# Altium project Test_Board.PrjPcb
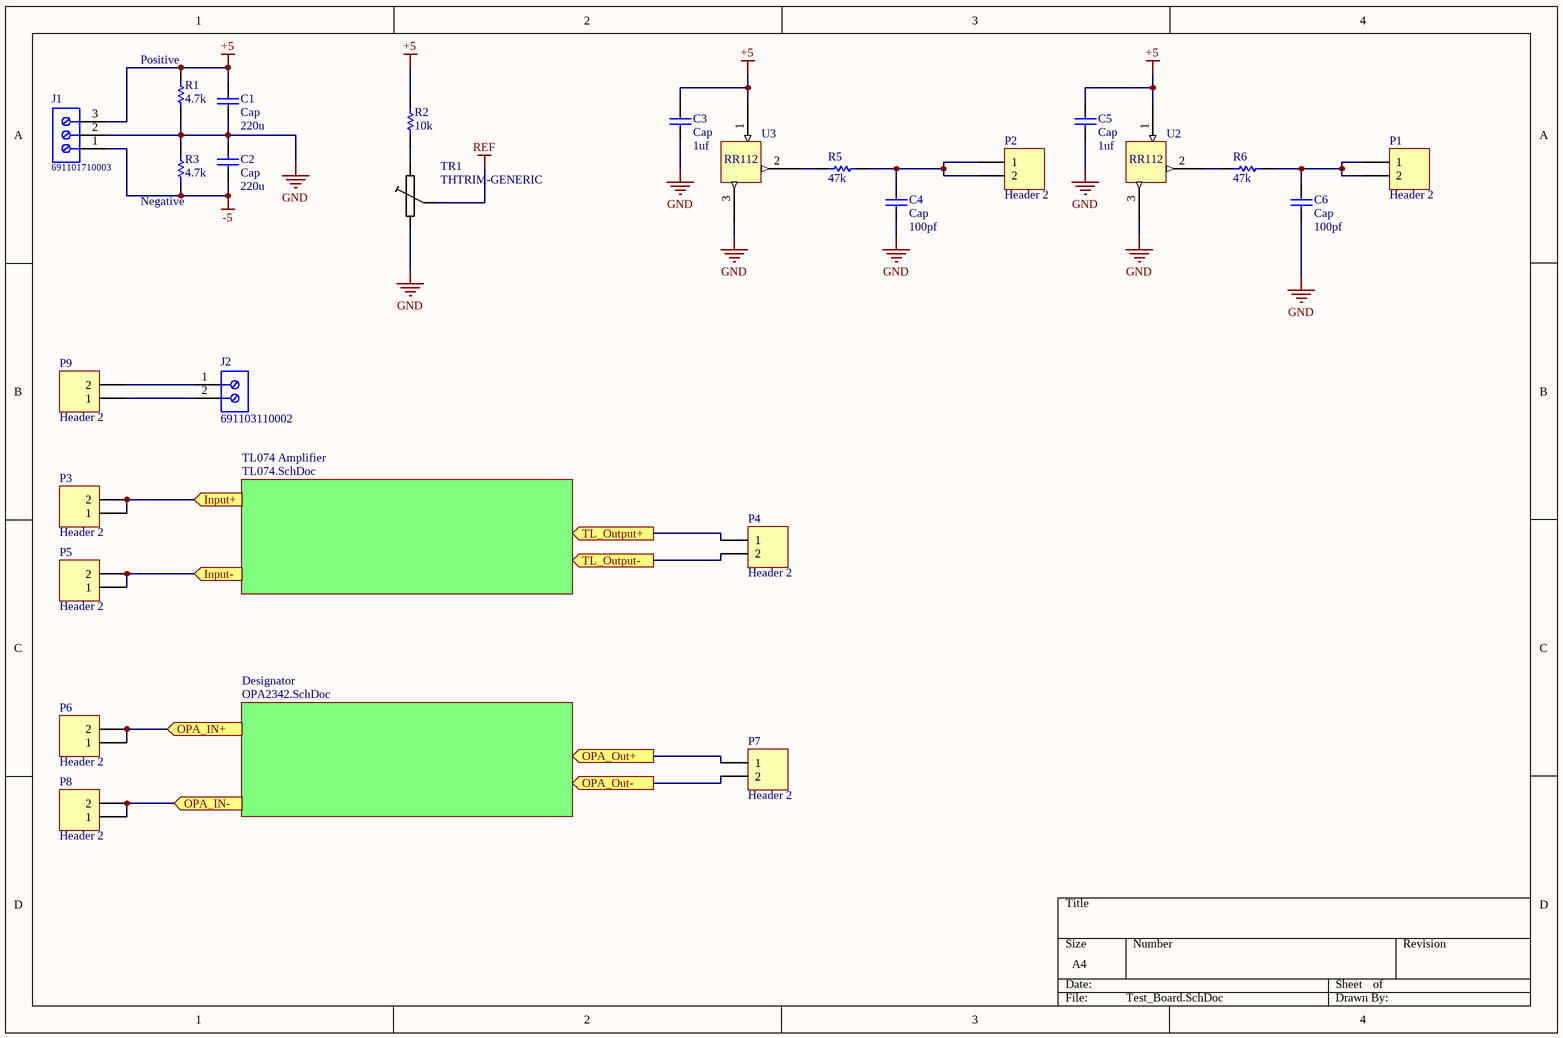
[diagram p0: Test_Board.SchDoc]
3 sheets, 50 parts. Net scope: flat (ports and power ports of the same name join across sheets).
Board file: TestBoard.PcbDoc
Sheets:
  Test_Board.SchDoc
    TL074 Amplifier = TL074.SchDoc
    Designator = OPA2342.SchDoc

## Sheet Test_Board.SchDoc
size A4; SheetNumber: 1; SheetTotal: 3

### Parts
C1  Cap  value 220u  [RAD-0.3]
C2  Cap  value 220u  [C1206]
C3  Cap  value 1uf  [C1206]
C4  Cap  value 100pf  [C1206]
C5  Cap  value 1uf  [C1206]
C6  Cap  value 100pf  [C1206]
J1  691101710003  [691101710003]
J2  691103110002  [691103110002]
P1  Header 2  [HDR1X2]
P2  Header 2  [HDR1X2]
P3  Header 2  [HDR1X2]
P4  Header 2  [HDR1X2]
P5  Header 2  [HDR1X2]
P6  Header 2  [HDR1X2]
P7  Header 2  [HDR1X2]
P8  Header 2  [HDR1X2]
P9  Header 2  [HDR1X2]
R1  4.7k  [RESC3216X89X51LL25T25]
R2  10k  [RESC3216X89X51LL25T25]
R3  4.7k  [RESC3216X89X51LL25T25]
R5  47k  [RESC3216X89X51LL25T25]
R6  47k  [RESC3216X89X51LL25T25]
TR1  THTRIM-GENERIC  [TRIMMER-MT]
U2  RR112-1G42-531  [SOT145P280X140-3N]  (value not drawn)
U3  RR112-1G42-531  [SOT145P280X140-3N]  (value not drawn)

### Sub-sheets
Designator = OPA2342.SchDoc: no entries
TL074 Amplifier = TL074.SchDoc: no entries

### Ports
Input+ (in), Input- (in), OPA_IN+ (in), OPA_IN- (in), OPA_Out+ (out), OPA_Out- (out), TL_Output+ (out), TL_Output- (out)

### Nets
+5: C1.1 C3.1 C5.1 J1.3 R1.2 R2.2 U2.1(Vdd) U3.1(Vdd)
-5: C2.2 J1.1 R3.1
GND: C1.2 C2.1 C3.2 C4.2 C5.2 C6.2 J1.2 R1.1 R3.2 TR1.1 U2.3(GND) U3.3(GND)
REF: TR1.W
NetC4_1: C4.1 P2.1 P2.2 R5.1
NetC6_1: C6.1 P1.1 P1.2 R6.1
NetJ2_1: J2.1 P9.2
NetJ2_2: J2.2 P9.1
NetP3_1: P3.1 P3.2 ; port Input+
NetP4_1: P4.1 ; port TL_Output+
NetP4_2: P4.2 ; port TL_Output-
NetP5_1: P5.1 P5.2 ; port Input-
NetP6_1: P6.1 P6.2 ; port OPA_IN+
NetP7_1: P7.1 ; port OPA_Out+
NetP7_2: P7.2 ; port OPA_Out-
NetP8_1: P8.1 P8.2 ; port OPA_IN-
NetR2_1: R2.1 TR1.2
NetR5_2: R5.2 U3.2(Output)
NetR6_2: R6.2 U2.2(Output)

### Notes on the sheet
- (near R1) Positive
- (near R3) Negative
- (in symbol CMP-010-0002465-1) RR112

### Library data of the parts
C1-C6 = Cap: Capacitor; Published: 8-Jun-2000; LatestRevisionDate: 17-Jul-2002; LatestRevisionNote: Re-released for DXP Platform.; PackageReference: RAD-0.3; Publisher: Altium Limited; PackageDescription: Radial Cap, Thru-Hole; 2 Leads; 0.3 in Pin Spacing
J1 = CMP-1502-03257-1: Series 101 - 5.00 mm Horizontal Entry Modular with Pressure Clamp WR-TBL, 3 pin; Manufacturer: Wurth Elektronik; Pitch: 5.00mm; Pin Number: 3; Publisher: WurthElektronik; Part Number: 691101710003; Operating Temperature: -40to105degC; Package Reference: 691101710003; Packaging: Box; Manufacturer URL: http://www.we-online.de; Datasheet URL: http://katalog.we-online.de/em/datasheet/6911017100xx.pdf; Mounting Technology: THT
J2 = CMP-1502-03254-1: Series 1031 - 3.50 mm Horizontal Entry Modular with Pressure Clamp WR-TBL, 2 pin; Manufacturer: Wurth Elektronik; Pin Number: 2; Pitch: 3.50mm; Datasheet URL: http://katalog.we-online.de/em/datasheet/6911031100xx.pdf; Package Reference: 691103110002; Publisher: WurthElektronik; Manufacturer URL: http://www.we-online.de; Mounting Technology: THT; Operating Temperature: -40to105degC; Part Number: 691103110002; Packaging: Box
P1-P9 = Header 2: Header, 2-Pin; LatestRevisionDate: 17-Jul-2002; LatestRevisionNote: Re-released for DXP Platform.; Publisher: Altium Limited
R1-R3 R5 R6 = CMP-2003-04376-1: Part Number: WSLP1206R0500FEA; Manufacturer: Vishay Dale
TR1 = THTRIM-GENERIC: TRIMMABLE RESISTOR
U2 U3 = CMP-010-0002465-1: TMR Sensor

## Sheet TL074.SchDoc
size A4; SheetNumber: 2; SheetTotal: 3
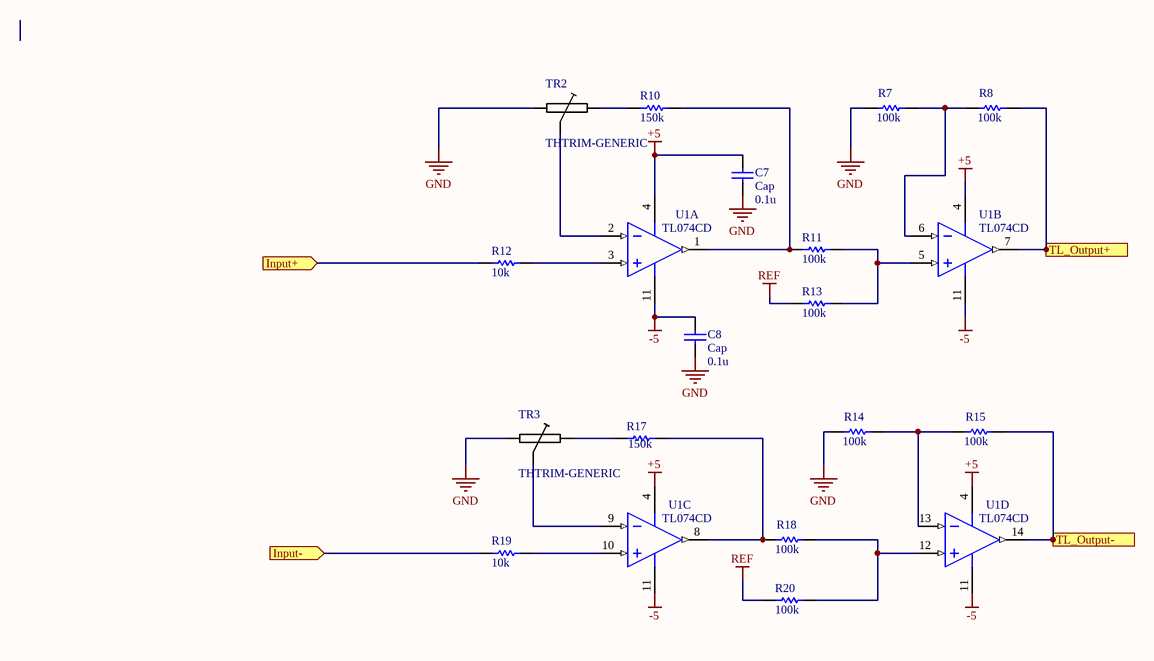
[diagram p1: TL074.SchDoc]

### Parts
C7  Cap  value 0.1u  [C1206]
C8  Cap  value 0.1u  [C1206]
R7  100k  [RESC3216X89X51LL25T25]
R8  100k  [RESC3216X89X51LL25T25]
R10  150k  [RESC3216X89X51LL25T25]
R11  100k  [RESC3216X89X51LL25T25]
R12  10k  [RESC3216X89X51LL25T25]
R13  100k  [RESC3216X89X51LL25T25]
R14  100k  [RESC3216X89X51LL25T25]
R15  100k  [RESC3216X89X51LL25T25]
R17  150k  [RESC3216X89X51LL25T25]
R18  100k  [RESC3216X89X51LL25T25]
R19  10k  [RESC3216X89X51LL25T25]
R20  100k  [RESC3216X89X51LL25T25]
TR2  THTRIM-GENERIC  [TRIMMER-MT]
TR3  THTRIM-GENERIC  [TRIMMER-MT]
U1  TL074CD  [D0014A_M]  (parts A,B,C,D of 4)

### Ports
Input+ (in), Input- (in), TL_Output+ (out), TL_Output- (out)

### Nets
+5: C7.1 U1.4(VCC+)
-5: C8.1 U1.11(VCC-)
GND: C7.2 C8.2 R7.2 R14.2 TR2.1 TR3.1
REF: R13.2 R20.2
NetP3_1: R12.2 ; port Input+
NetP4_1: R8.1 U1.7(OUT2) ; port TL_Output+
NetP4_2: R15.1 U1.14(OUT4) ; port TL_Output-
NetP5_1: R19.2 ; port Input-
NetR7_1: R7.1 R8.2 U1.6(IN2-)
NetR10_1: R10.1 R11.2 U1.1(OUT1)
NetR10_2: R10.2 TR2.2
NetR11_1: R11.1 R13.1 U1.5(IN2+)
NetR12_1: R12.1 U1.3(IN1+)
NetR14_1: R14.1 R15.2 U1.13(IN4-)
NetR17_1: R17.1 R18.2 U1.8(OUT3)
NetR17_2: R17.2 TR3.2
NetR18_1: R18.1 R20.1 U1.12(IN4+)
NetR19_1: R19.1 U1.10(IN3+)
NetTR2_W: TR2.W U1.2(IN1-)
NetTR3_W: TR3.W U1.9(IN3-)

### Library data of the parts
C7 C8 = Cap: Capacitor; Published: 8-Jun-2000; LatestRevisionDate: 17-Jul-2002; LatestRevisionNote: Re-released for DXP Platform.; PackageReference: RAD-0.3; Publisher: Altium Limited; PackageDescription: Radial Cap, Thru-Hole; 2 Leads; 0.3 in Pin Spacing
R7 R8 R10-R15 R17-R20 = CMP-2003-04376-1: as R1 on sheet Test_Board
TR2 TR3 = THTRIM-GENERIC: TRIMMABLE RESISTOR
U1 = CMP-0017-00005-2: Quad Low-Noise JFET-Input General-Purpose Operational Amplifier, 7 to 36 V, 0 to 70 degC, 14-pin SOIC (D14), Green (RoHS & no Sb/Br); Manufacturer: Texas Instruments; Iq per channel(Max)(mA): 2.5; CMRR(Min)(dB): 70; Offset Drift(Typ)(uV/C): 18; Slew Rate(Typ)(V/us): 13; Rating: Military; Number of Channels: 4; Total Supply Voltage(Min)(+5V is 5, +/-5V is 10): 7; Sub Family: General Purpose Amplifier, High Supply Voltage Amplifier (>=30V); IIB(Max)(pA): 200; Total Supply Voltage(Max)(+5V is 5, +/-5V is 10): 36; Vio (25C)(Max)(mV): 10; GBW(Typ)(MHz): 3; ComponentLink1Description: Manufacturer URL; ComponentLink2Description: Datasheet; PackageDescription: 14-Pin Plastic Small Outline, Body 8.65 x 3.90 mm, Pitch 1.27 mm; Mounting Technology: Surface Mount; ComponentLink2URL: http://www.ti.com/lit/ds/symlink/tl074.pdf; PartNumber: TL074CD; Vn at 1kHz(Typ)(nV/rtHz): 18; Eco-Plan: Green (RoHS & no Sb/Br); ComponentLink1URL: http://www.ti.com/; PackageVersion: 4040047-5/M, 06/2011; ComponentLink3Description: Package Specification; DatasheetVersion: SLOS080J; Code_JEDEC: MS-012; PackageReference: D0014A; ComponentLink3URL: http://www.ti.com/lit/ml/mpds177g/mpds177g.pdf

## Sheet OPA2342.SchDoc
size A4; SheetNumber: 3; SheetTotal: 3
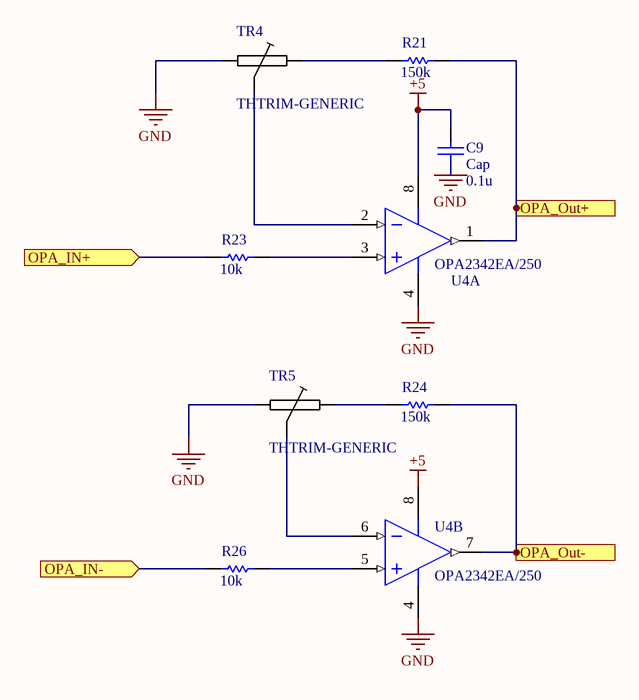
[diagram p2: OPA2342.SchDoc]

### Parts
C9  Cap  value 0.1u  [C1206]
R21  150k  [RESC3216X89X51LL25T25]
R23  10k  [RESC3216X89X51LL25T25]
R24  150k  [RESC3216X89X51LL25T25]
R26  10k  [RESC3216X89X51LL25T25]
TR4  THTRIM-GENERIC  [TRIMMER-MT]
TR5  THTRIM-GENERIC  [TRIMMER-MT]
U4  OPA2342EA/250  [DGK0008A_M]  (parts A,B of 2)

### Ports
OPA_IN+ (in), OPA_IN- (in), OPA_Out+ (out), OPA_Out- (out)

### Nets
+5: C9.1 U4.8(V+)
GND: C9.2 TR4.1 TR5.1 U4.4(V-)
NetP6_1: R23.2 ; port OPA_IN+
NetP7_1: R21.1 U4.1(OUT_A) ; port OPA_Out+
NetP7_2: R24.1 U4.7(OUT_B) ; port OPA_Out-
NetP8_1: R26.2 ; port OPA_IN-
NetR21_2: R21.2 TR4.2
NetR23_1: R23.1 U4.3(IN_A+)
NetR24_2: R24.2 TR5.2
NetR26_1: R26.1 U4.5(IN_B+)
NetTR4_W: TR4.W U4.2(IN_A-)
NetTR5_W: TR5.W U4.6(IN_B-)

### Library data of the parts
C9 = Cap: Capacitor; Published: 8-Jun-2000; LatestRevisionDate: 17-Jul-2002; LatestRevisionNote: Re-released for DXP Platform.; PackageReference: RAD-0.3; Publisher: Altium Limited; PackageDescription: Radial Cap, Thru-Hole; 2 Leads; 0.3 in Pin Spacing
R21 R23 R24 R26 = CMP-2003-04376-1: as R1 on sheet Test_Board
TR4 TR5 = THTRIM-GENERIC: TRIMMABLE RESISTOR
U4 = CMP-0271-00302-3: Low Cost, Low Power, Rail-to-Rail Operational Amplifier MicroAmplifier(TM) Series, 2.7 to 5.5 V, -40 to 85 degC, 8-pin SOP (DGK8), Green (RoHS & no Sb/Br); Manufacturer: Texas Instruments; IIB(Max)(pA): 10; CMRR(Min)(dB): 74; Iq per channel(Max)(mA): 0.25; Vio (25C)(Max)(mV): 6; Packing: SMALL T&R; Total Supply Voltage(Min)(+5V is 5, +/-5V is 10): 2.7; Number of Channels: 2; GBW(Typ)(MHz): 1; Offset Drift(Typ)(uV/C): 3; Sub Family: Low Input Bias Current Amp (<=10pA), Low Power Amp (<=500uA), Low Supply Voltage Amplifier (<=2.7V), Precision Amplifier; Total Supply Voltage(Max)(+5V is 5, +/-5V is 10): 5.5; Rating: Catalog; DatasheetVersion: SBOS106A; ComponentLink1Description: Manufacturer URL; PartNumber: OPA2342EA/250; ComponentLink2URL: http://www.ti.com/lit/ds/symlink/opa2342.pdf; ComponentLink3Description: Package Specification; PackageReference: DGK0008A; Eco-Plan: Green (RoHS & no Sb/Br); Slew Rate(Typ)(V/us): 1; Code_JEDEC: MO-187; ComponentLink1URL: http://www.ti.com/; ComponentLink3URL: http://www.ti.com/litv/pdf/mpds028d; PackageDescription: 8-Pin Thin Small Outline, Body 3 x 3 mm, Pitch 0.65 mm; PackageVersion: 4073329/E, 05/2006; ComponentLink2Description: Datasheet; Mounting Technology: Surface Mount

## Nets that join several sheets
+5: Test_Board (8 pins), TL074 (C7.1 U1.4), OPA2342 (C9.1 U4.8)
-5: Test_Board (C2.2 J1.1 R3.1), TL074 (C8.1 U1.11)
GND: Test_Board (12 pins), TL074 (6 pins), OPA2342 (C9.2 TR4.1 TR5.1 U4.4)
REF: Test_Board (TR1.W), TL074 (R13.2 R20.2)
NetP3_1: Test_Board (P3.1 P3.2), TL074 (R12.2)
NetP4_1: Test_Board (P4.1), TL074 (R8.1 U1.7)
NetP4_2: Test_Board (P4.2), TL074 (R15.1 U1.14)
NetP5_1: Test_Board (P5.1 P5.2), TL074 (R19.2)
NetP6_1: Test_Board (P6.1 P6.2), OPA2342 (R23.2)
NetP7_1: Test_Board (P7.1), OPA2342 (R21.1 U4.1)
NetP7_2: Test_Board (P7.2), OPA2342 (R24.1 U4.7)
NetP8_1: Test_Board (P8.1 P8.2), OPA2342 (R26.2)